# EAGLE design VIC20_Diag_UP (EAGLE 9.6.2)
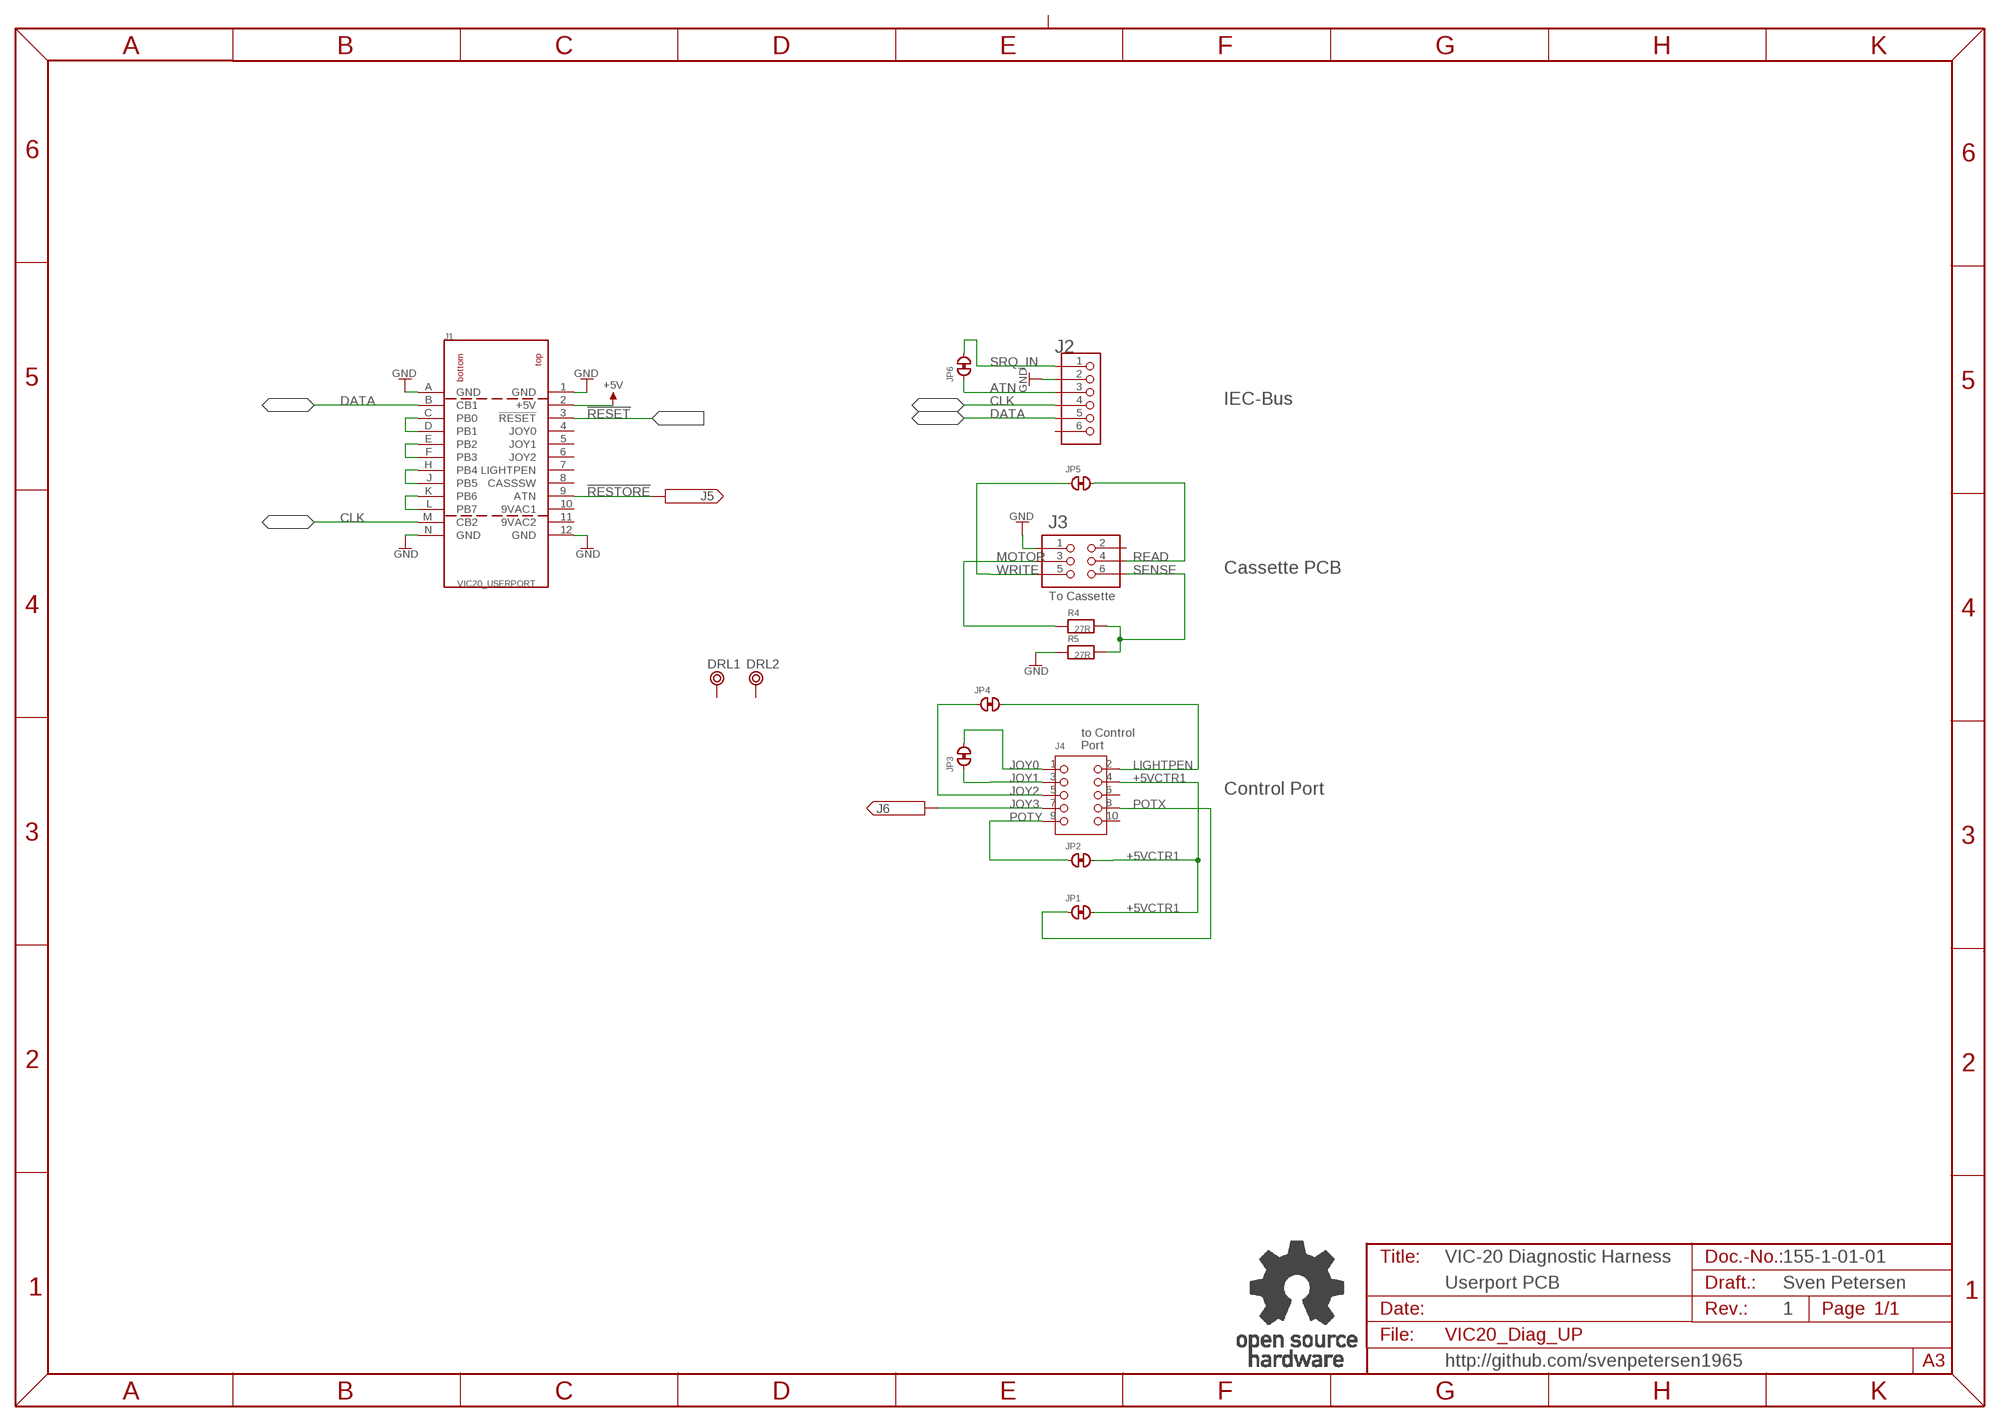
[diagram p0: schematic, sheet 1]

## Parts
DRL1  BOHR3,5  [BOHR3,5]
DRL2  BOHR3,5  [BOHR3,5]
J1  VIC20_USERPORT  [USERPORT]
J2  6410-6P  [6410-6P]
J3  2X03WV  [2X03WV]
J4  2X05WV  [2X05WV]
J5  PINHD-1X1  [1X01]
J6  PINHD-1X1  [1X01]
JP1  CLOSED  [CP_CL]
JP2  CLOSED  [CP_CL]
JP3  CLOSED  [CP_CL]
JP4  CLOSED  [CP_CL]
JP5  CLOSED  [CP_CL]
JP6  CLOSED  [CP_CL]
R4  27R  RES04  [R-10]
R5  27R  RES04  [R-10]
U$2  OPEN_SOURCE_HW  [OPENHW]

## Nets
!RESET: J1.3(!RESET)
!RESTORE: J1.9(ATN) J5.1
+5V: J1.2(+5V)
+5VCTR1: J4.4 JP1.2 JP2.2
ATN: J2.3 JP6.1
CLK: J1.M(CB2) J2.4
DATA: J1.B(CB1) J2.5
GND: J1.1(GND) J1.12(GND) J1.A(GND) J1.N(GND) J2.2 J3.1 R5.1
JOY0: J4.1 JP3.2
JOY1: J4.3 JP3.1
JOY2: J4.5 JP4.1
JOY3: J4.7 J6.1
LIGHTPEN: J4.2 JP4.2
MOTOR: J3.3 R4.1
N$1: J1.C(PB0) J1.D(PB1)
N$2: J1.E(PB2) J1.F(PB3)
N$3: J1.H(PB4) J1.J(PB5)
N$4: J1.K(PB6) J1.L(PB7)
POTX: J4.8 JP1.1
POTY: J4.9 JP2.1
READ: J3.4 JP5.2
SENSE: J3.6 R4.2 R5.2
SRQ_IN: J2.1 JP6.2
WRITE: J3.5 JP5.1
Unconnected: DRL1.P$1 DRL2.P$1 J1.4(JOY0) J1.5(JOY1) J1.6(JOY2) J1.7(LIGHTPEN) J1.8(CASSSW) J2.6 J3.2 J4.6 J4.10

## Notes on the sheet
- IEC-Bus
- Cassette PCB
- To Cassette
- to Control
  Port
- Control Port
- VIC-20 Diagnostic Harness | 155-1-01-01
- Userport PCB | Sven Petersen
- 1
- http://github.com/svenpetersen1965

## Power pins joined to a net without a drawn wire
9VAC1: J1.10(9VAC1)
9VAC2: J1.11(9VAC2)

## Library data of the parts
DRL1 DRL2 = Mech_Bohr:BOHR3,5
J1 = Commodore:VIC20_USERPORT
J2 = MOLEX:6410-6P: 6410/22-27-2061
J3 = PINHEAD:2X03WV
J4 = PINHEAD:2X05WV
J5 J6 = PINHEAD:PINHD-1X1
JP1-JP6 = Cutpad:CLOSED: Closed Cutpad
R4 R5 = DISCRETE:RES04
U$2 = Logo:OPEN_SOURCE_HW

## Board
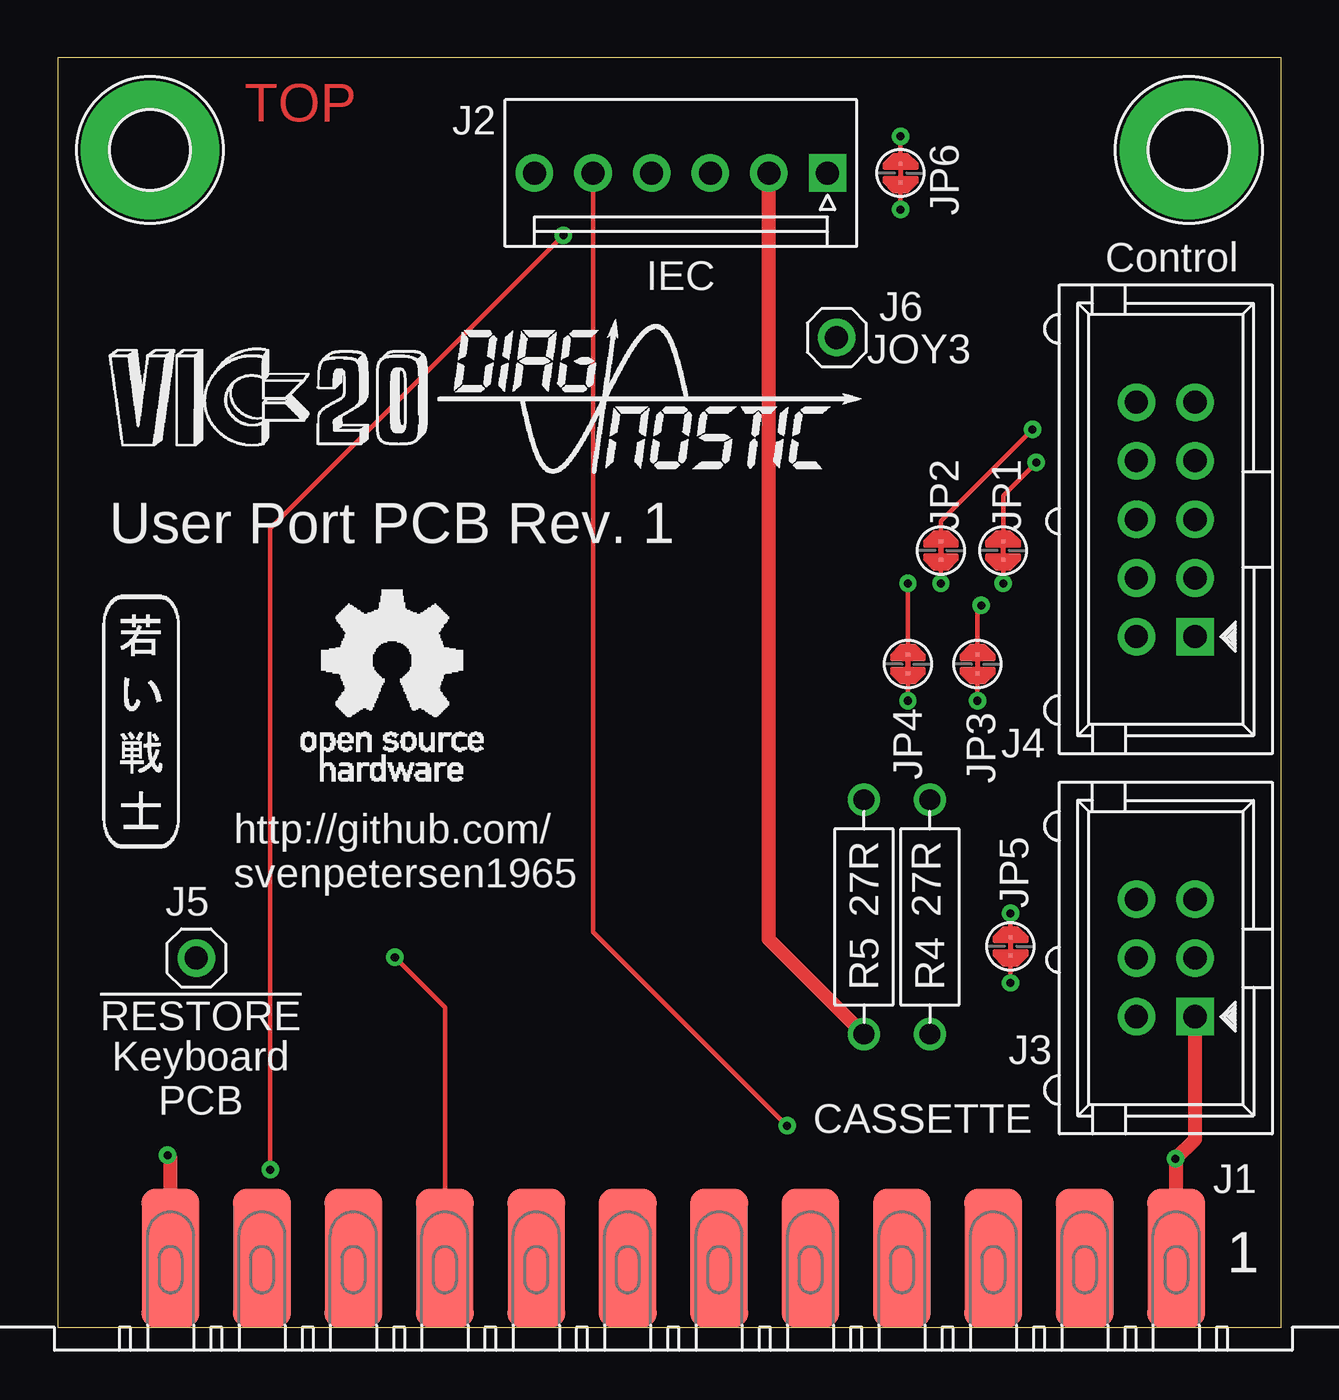
[diagram p1: board, top side]
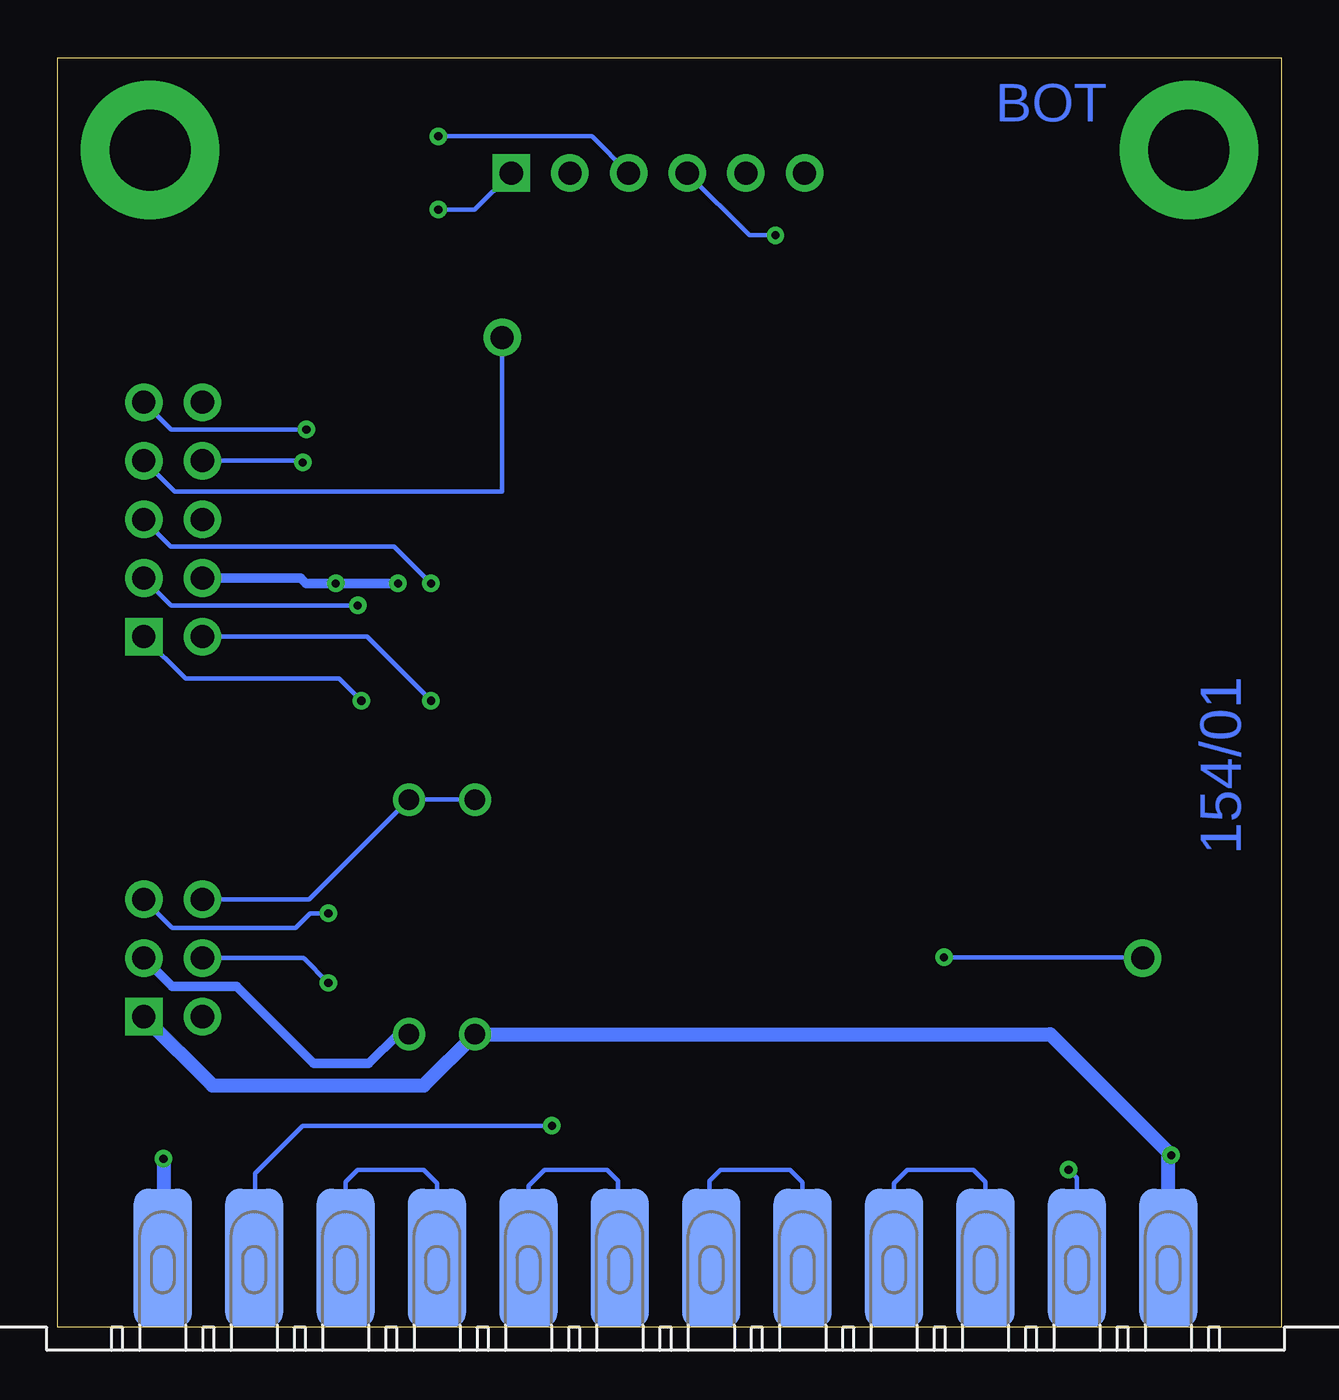
[diagram p2: board, bottom side, seen from below]

Size 53 x 55 mm. Coordinates in mm from the lower left corner, seen from the top.
Outline: 0,0 53,0 53,55 0.03,55 arc90 0,54.98 0,0
Copper layers (1*16): Top 0.035mm / dielectric 1.5mm / Bottom 0.035mm
Design rules "default *": minimum track width 6mil, minimum drill 0.35mm, track to track 6mil, track to pad 6mil, pad to pad 6mil, via to via 6mil, smd to smd 6mil, copper to edge 40mil, drill to drill 6mil, minimum pad ring 10mil, minimum via ring 8mil, stop-mask expansion 4mil, vias tented up to drill 25mil, thermal gap 10mil

### Footprints (pad centres in the part's own frame; a part is rotated, then mirrored left to right if it is on the bottom)
BOHR3,5 = drill 3.5 pad 6: P$1 0,0
USERPORT = smd 2.5 x 6: 1 -21.78,-3; 2 -17.82,-3; 3 -13.86,-3; 4 -9.9,-3; 5 -5.94,-3; 6 -1.98,-3; 7 1.98,-3; 8 5.94,-3; 9 9.9,-3; 10 13.86,-3; 11 17.82,-3; 12 21.78,-3 | smd 2.5 x 6 bottom: A -21.78,-3; B -17.82,-3; C -13.86,-3; D -9.9,-3; E -5.94,-3; F -1.98,-3; H 1.98,-3; J 5.94,-3; K 9.9,-3; L 13.86,-3; M 17.82,-3; N 21.78,-3
6410-6P = drill 1 pad 1.626 square: 1 -6.35,0 | drill 1 pad 1.626: 2 -3.81,0; 3 -1.27,0; 4 1.27,0; 5 3.81,0; 6 6.35,0
2X03WV = drill 1 pad 1.626 square: 1 -2.54,-1.27 | drill 1 pad 1.626: 2 -2.54,1.27; 3 0,-1.27; 4 0,1.27; 5 2.54,-1.27; 6 2.54,1.27
2X05WV = drill 1 pad 1.626 square: 1 -5.08,-1.27 | drill 1 pad 1.626: 2 -5.08,1.27; 3 -2.54,-1.27; 4 -2.54,1.27; 5 0,-1.27; 6 0,1.27; 7 2.54,-1.27; 8 2.54,1.27; 9 5.08,-1.27; 10 5.08,1.27
1X01 = drill 1 pad 1.626: 1 0,0
CP_CL = smd 0.152 x 0.152: 1 -0.4,0; 2 0.4,0
R-10 = drill 0.889 pad 1.397: 1 -5.08,0; 2 5.08,0

### Placement (x,y rotation side)
DRL1  4,51 0 top
DRL2  49,51 0 top
J1  26.67,0 180 top
J2  27,50 180 top
J3  48,16 90 top
J4  48,35 90 top
J5  6,16 0 top
J6  33.74,42.88 0 top
JP1  40.96,33.66 270 top
JP2  38.26,33.66 270 top
JP3  39.85,28.73 270 top
JP4  36.83,28.73 270 top
JP5  41.27,16.51 270 top
JP6  36.51,50.01 270 top
R4  37.78,17.78 90 top
R5  34.92,17.78 90 top
U$2  10.55,23.67 0 top
U$10  [SVEN_TAG]  3.65,26.35 0 top
U$17  [PCB-TITLE/]  0,63.5 0 top  (outside the outline)
U$18  [2LAYER]  8.1,52.23 0 top
U$19  [VIC20_DIAG]  2.22,36.99 0 top

### Tracks (layer width: path | path; a pad name or v marks a point on that pad's centre or on a via)
!RESTORE  (via drill 0.35)
  Top 0.203: J1.9 16.77,13.87 v14.61,16.03
  Bottom 0.203: v14.61,16.03 6.03,16.03 J5.1
+5VCTR1  (via drill 0.35)
  Top 0.203: JP2.2 v38.26,32.23 | JP1.2 v40.96,32.23
  Bottom 0.406: J4.4 42.47,32.46 42.24,32.23 v40.96,32.23 v38.26,32.23
ATN  (via drill 0.35)
  Top 0.203: JP6.1 v36.51,51.59
  Bottom 0.203: J2.3 29.86,51.59 v36.51,51.59
CLK  (via drill 0.35)
  Top 0.203: v9.21,6.83 9.21,34.61 v21.91,47.31
  Bottom 0.203: J1.M 8.85,6.47 v9.21,6.83 | v21.91,47.31 23.04,47.31 J2.4
DATA  (via drill 0.35)
  Top 0.203: v31.59,8.73 23.19,17.13 J2.5
  Bottom 0.203: J1.B 44.45,3.04 44.45,6.67 42.39,8.73 v31.59,8.73
GND  (via drill 0.35)
  Top 0.61: J1.1 48.45,7.27 v48.42,7.3 49.27,8.15 J3.1 | R5.1 30.8,16.83 30.8,49.99 J2.2 | 4.76,3.13 J1.N 4.89,7.33 v4.76,7.46
  Bottom 0.61: v48.42,7.3 48.42,3.03 J1.1 | J3.1 46.29,10.48 37.15,10.48 R5.1 10,12.7 v4.76,7.46 4.89,7.33 J1.N
JOY0  (via drill 0.35)
  Top 0.203: JP3.2 v39.85,27.15
  Bottom 0.203: J4.1 49.27,29.9 47.47,28.1 40.8,28.1 v39.85,27.15
JOY1  (via drill 0.35)
  Top 0.203: v40.01,31.27 39.85,31.11 JP3.1
  Bottom 0.203: J4.3 48.08,31.27 v40.01,31.27
JOY2  (via drill 0.35)
  Top 0.203: v36.83,32.23 JP4.1
  Bottom 0.203: J4.5 49.27,34.98 48.1,33.81 38.42,33.81 v36.83,32.23
JOY3
  Bottom 0.203: J4.7 47.92,36.2 33.74,36.2 J6.1
LIGHTPEN  (via drill 0.35)
  Top 0.203: JP4.2 v36.83,27.15
  Bottom 0.203: v36.83,27.15 39.6,29.92 J4.2
MOTOR
  Bottom 0.203: R4.1 38.26,12.7
  Bottom 0.406: 38.26,12.7 39.53,11.43 41.91,11.43 45.24,14.76 48.03,14.76 J3.3
N$1
  Bottom 0.203: J1.D 36.57,6.25 37.15,6.83 40.01,6.83 40.53,6.3 J1.C
N$2
  Bottom 0.203: J1.F 28.73,3.08 28.73,6.35 29.21,6.83 31.91,6.83 32.61,6.12 J1.E
N$3
  Bottom 0.203: J1.J 20.73,6.28 21.27,6.83 24.29,6.83 24.77,6.35 24.77,3.08 J1.H
N$4
  Bottom 0.203: J1.K 16.77,6.25 16.19,6.83 13.34,6.83 12.81,6.3 J1.L
POTX  (via drill 0.35)
  Top 0.203: JP1.1 40.96,36.04 v42.39,37.47
  Bottom 0.203: v42.39,37.47 42.46,37.54 J4.8
POTY  (via drill 0.35)
  Top 0.203: JP2.1 38.26,34.92 v42.23,38.89
  Bottom 0.203: v42.23,38.89 48.08,38.89 J4.9
READ  (via drill 0.35)
  Top 0.203: JP5.2 v41.27,14.92
  Bottom 0.203: J3.4 43.94,16 42.35,16 v41.27,14.92
SENSE
  Bottom 0.203: J3.6 42.1,18.54 R4.2 R5.2
SRQ_IN  (via drill 0.35)
  Top 0.203: JP6.2 v36.51,48.42
  Bottom 0.203: J2.1 34.93,48.42 v36.51,48.42
WRITE  (via drill 0.35)
  Top 0.203: JP5.1 v41.27,17.94
  Bottom 0.203: v41.27,17.94 42.07,17.94 42.7,17.3 48.03,17.3 J3.5

### Text on the board
Bottom: 154/01
tPlace: Control | IEC | JOY3 | User Port PCB Rev. 1 | http://github.com/ / svenpetersen1965 | 27R | 27R | !RESTORE | Keyboard / PCB | CASSETTE | 1
Document: 154-2-01-01 | Sven Petersen / 2021 | 35µm | 2 | 1